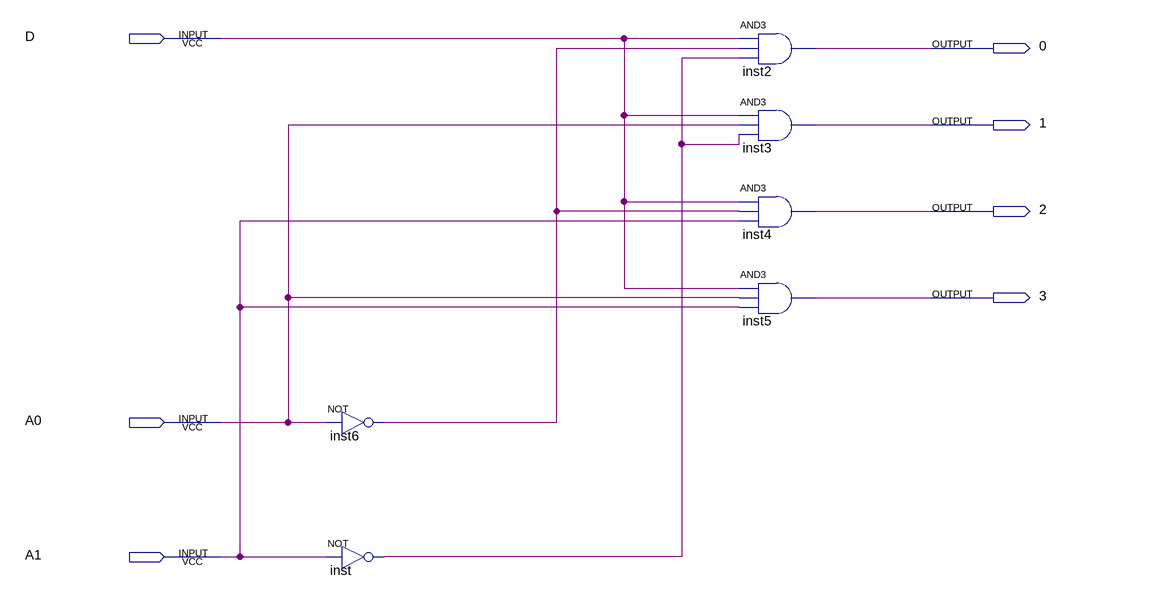
[diagram p0: schematic sheet]
// Quartus schematic demux2.bdf as structural Verilog: 6 symbols, 7 pins
module demux2 (
  input  D,
  input  A0,
  input  A1,
  output \0 ,
  output \1 ,
  output \2 ,
  output \3 
);

  wire inst6_out, inst_out;

  not inst6 (inst6_out, A0);
  not inst (inst_out, A1);
  and inst2 (\0 , D, inst6_out, inst_out);
  and inst3 (\1 , D, A0, inst_out);
  and inst4 (\2 , D, inst6_out, A1);
  and inst5 (\3 , D, A0, A1);
endmodule
